# EAGLE design stm32-v1 (EAGLE 7.3.0)
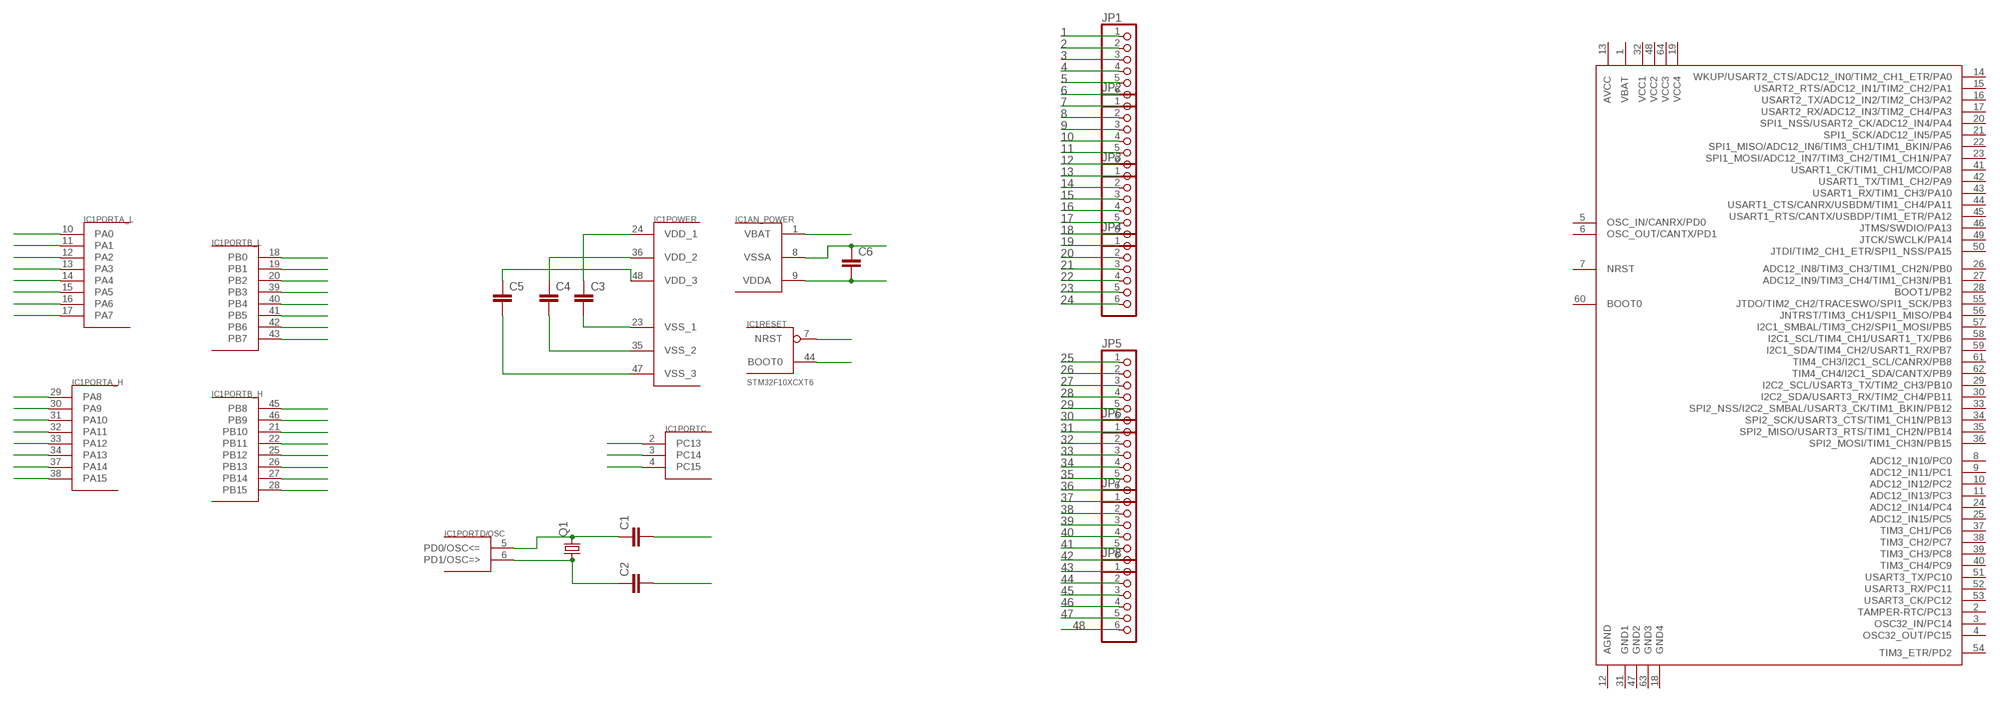
[diagram p0: schematic, sheet 1]

## Parts
C1  CAP1206  [1206]
C2  CAP1206  [1206]
C3  CAP1206  [1206]
C4  CAP1206  [1206]
C5  CAP1206  [1206]
C6  CAP1206  [1206]
IC1  STM32F10XCXT6  [TQFP48]
JP1  PINHD-1X6  [1X06]
JP2  PINHD-1X6  [1X06]
JP3  PINHD-1X6  [1X06]
JP4  PINHD-1X6  [1X06]
JP5  PINHD-1X6  [1X06]
JP6  PINHD-1X6  [1X06]
JP7  PINHD-1X6  [1X06]
JP8  PINHD-1X6  [1X06]
Q1  CRYSTAL5X3  [CRYSTAL-SMD-5X3]
U$2  STM32F103X8/B  [LQFP64]

## Nets
1: IC1.1(AN_POWER:VBAT) JP1.1
2: IC1.2(PORTC:PC13) JP1.2
3: IC1.3(PORTC:PC14) JP1.3
4: IC1.4(PORTC:PC15) JP1.4
5: C1.2 JP1.5
6: C2.2 JP1.6
7: IC1.7(RESET:NRST) JP2.1
8: C6.1 IC1.8(AN_POWER:VSSA) JP2.2
9: C6.2 IC1.9(AN_POWER:VDDA) JP2.3
10: IC1.10(PORTA_L:PA0) JP2.4
11: IC1.11(PORTA_L:PA1) JP2.5
12: IC1.12(PORTA_L:PA2) JP2.6
13: IC1.13(PORTA_L:PA3) JP3.1
14: IC1.14(PORTA_L:PA4) JP3.2
15: IC1.15(PORTA_L:PA5) JP3.3
16: IC1.16(PORTA_L:PA6) JP3.4
17: IC1.17(PORTA_L:PA7) JP3.5
18: IC1.18(PORTB_L:PB0) JP3.6
19: IC1.19(PORTB_L:PB1) JP4.1
20: IC1.20(PORTB_L:PB2) JP4.2
21: IC1.21(PORTB_H:PB10) JP4.3
22: IC1.22(PORTB_H:PB11) JP4.4
23: C3.2 IC1.23(POWER:VSS_1) JP4.5
24: C3.1 IC1.24(POWER:VDD_1) JP4.6
25: IC1.25(PORTB_H:PB12) JP5.1
26: IC1.26(PORTB_H:PB13) JP5.2
27: IC1.27(PORTB_H:PB14) JP5.3
28: IC1.28(PORTB_H:PB15) JP5.4
29: IC1.29(PORTA_H:PA8) JP5.5
30: IC1.30(PORTA_H:PA9) JP5.6
31: IC1.31(PORTA_H:PA10) JP6.1
32: IC1.32(PORTA_H:PA11) JP6.2
33: IC1.33(PORTA_H:PA12) JP6.3
34: IC1.34(PORTA_H:PA13) JP6.4
35: C4.2 IC1.35(POWER:VSS_2) JP6.5
36: C4.1 IC1.36(POWER:VDD_2) JP6.6
37: IC1.37(PORTA_H:PA14) JP7.1
38: IC1.38(PORTA_H:PA15) JP7.2
39: IC1.39(PORTB_L:PB3) JP7.3
40: IC1.40(PORTB_L:PB4) JP7.4
41: IC1.41(PORTB_L:PB5) JP7.5
42: IC1.42(PORTB_L:PB6) JP7.6
43: IC1.43(PORTB_L:PB7) JP8.1
44: IC1.44(RESET:BOOT0) JP8.2
45: IC1.45(PORTB_H:PB8) JP8.3
46: IC1.46(PORTB_H:PB9) JP8.4
47: C5.2 IC1.47(POWER:VSS_3) JP8.5
48: C5.1 IC1.48(POWER:VDD_3) JP8.6
N$9: C1.1 IC1.5(PORTD/OSC:PD0/OSC<=) Q1.3
N$10: C2.1 IC1.6(PORTD/OSC:PD1/OSC=>) Q1.1
Unconnected: U$2.1(VBAT) U$2.2(TAMPER-RTC/PC13) U$2.3(OSC32_IN/PC14) U$2.4(OSC32_OUT/PC15) U$2.5(OSC_IN/CANRX/PD0) U$2.6(OSC_OUT/CANTX/PD1) U$2.7(NRST) U$2.8(ADC12_IN10/PC0) U$2.9(ADC12_IN11/PC1) U$2.10(ADC12_IN12/PC2) U$2.11(ADC12_IN13/PC3) U$2.12(AGND) U$2.13(AVCC) U$2.14(WKUP/USART2_CTS/ADC12_IN0/TIM2_CH1_ETR/PA0) U$2.15(USART2_RTS/ADC12_IN1/TIM2_CH2/PA1) U$2.16(USART2_TX/ADC12_IN2/TIM2_CH3/PA2) U$2.17(USART2_RX/ADC12_IN3/TIM2_CH4/PA3) U$2.18(GND4) U$2.19(VCC4) U$2.20(SPI1_NSS/USART2_CK/ADC12_IN4/PA4) U$2.21(SPI1_SCK/ADC12_IN5/PA5) U$2.22(SPI1_MISO/ADC12_IN6/TIM3_CH1/TIM1_BKIN/PA6) U$2.23(SPI1_MOSI/ADC12_IN7/TIM3_CH2/TIM1_CH1N/PA7) U$2.24(ADC12_IN14/PC4) U$2.25(ADC12_IN15/PC5) U$2.26(ADC12_IN8/TIM3_CH3/TIM1_CH2N/PB0) U$2.27(ADC12_IN9/TIM3_CH4/TIM1_CH3N/PB1) U$2.28(BOOT1/PB2) U$2.29(I2C2_SCL/USART3_TX/TIM2_CH3/PB10) U$2.30(I2C2_SDA/USART3_RX/TIM2_CH4/PB11) U$2.31(GND1) U$2.32(VCC1) U$2.33(SPI2_NSS/I2C2_SMBAL/USART3_CK/TIM1_BKIN/PB12) U$2.34(SPI2_SCK/USART3_CTS/TIM1_CH1N/PB13) U$2.35(SPI2_MISO/USART3_RTS/TIM1_CH2N/PB14) U$2.36(SPI2_MOSI/TIM1_CH3N/PB15) U$2.37(TIM3_CH1/PC6) U$2.38(TIM3_CH2/PC7) U$2.39(TIM3_CH3/PC8) U$2.40(TIM3_CH4/PC9) U$2.41(USART1_CK/TIM1_CH1/MCO/PA8) U$2.42(USART1_TX/TIM1_CH2/PA9) U$2.43(USART1_RX/TIM1_CH3/PA10) U$2.44(USART1_CTS/CANRX/USBDM/TIM1_CH4/PA11) U$2.45(USART1_RTS/CANTX/USBDP/TIM1_ETR/PA12) U$2.46(JTMS/SWDIO/PA13) U$2.47(GND2) U$2.48(VCC2) U$2.49(JTCK/SWCLK/PA14) U$2.50(JTDI/TIM2_CH1_ETR/SPI1_NSS/PA15) U$2.51(USART3_TX/PC10) U$2.52(USART3_RX/PC11) U$2.53(USART3_CK/PC12) U$2.54(TIM3_ETR/PD2) U$2.55(JTDO/TIM2_CH2/TRACESWO/SPI1_SCK/PB3) U$2.56(JNTRST/TIM3_CH1/SPI1_MISO/PB4) U$2.57(I2C1_SMBAL/TIM3_CH2/SPI1_MOSI/PB5) U$2.58(I2C1_SCL/TIM4_CH1/USART1_TX/PB6) U$2.59(I2C1_SDA/TIM4_CH2/USART1_RX/PB7) U$2.60(BOOT0) U$2.61(TIM4_CH3/I2C1_SCL/CANRX/PB8) U$2.62(TIM4_CH4/I2C1_SDA/CANTX/PB9) U$2.63(GND3) U$2.64(VCC3)

## Library data of the parts
C1-C6 = SparkFun:CAP: Capacitor Standard 0603 ceramic capacitor, and 0.1" leaded capacitor.
IC1 = stm32:STM32F10XCXT6: ST STM32F101/103 48pin LQFP
JP1-JP8 = pinhead:PINHD-1X6: PIN HEADER
Q1 = SparkFun:CRYSTAL: Crystals Various standard crystals. Proven footprints. Spark Fun Electronics SKU : COM-00534
U$2 = stm32f103rx_lqfp64:STM32F103X8/B: Medium-density performance line ARM-based 32-bit MCU with 64 or 128 KB Flash, USB, CAN, 7 timers, 2 ADCs, 9 communication interfaces

## Board
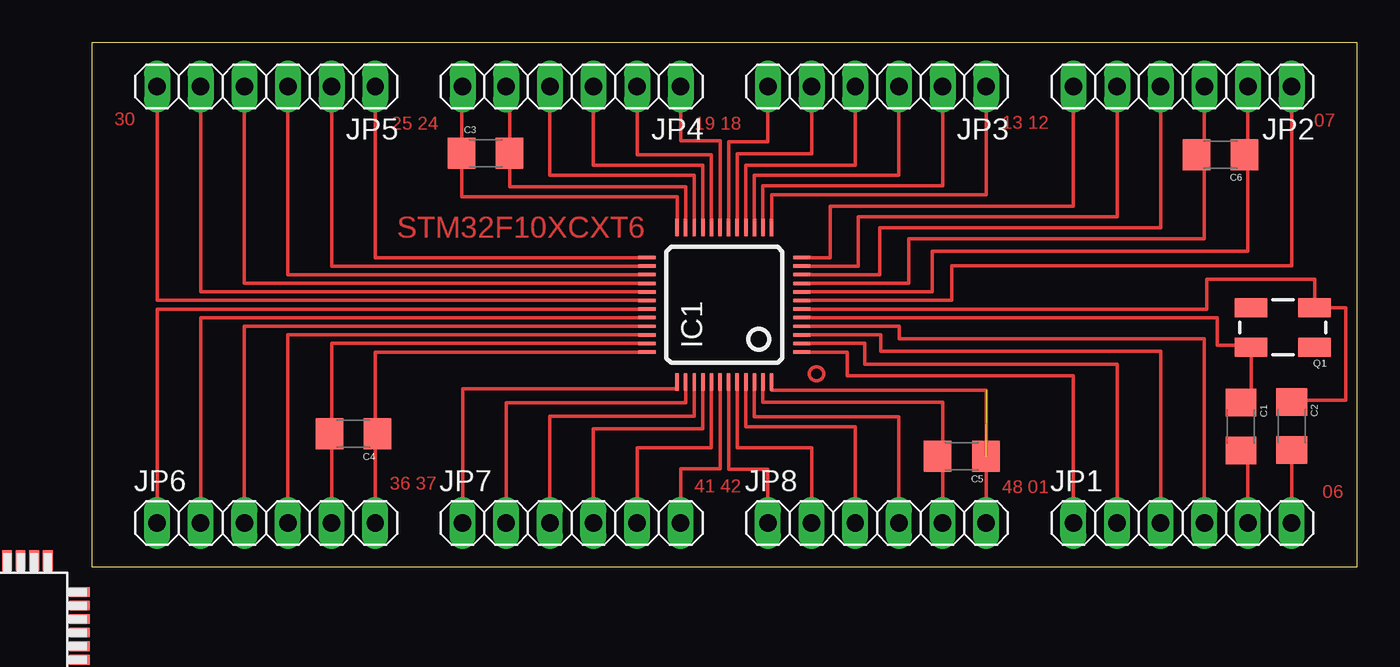
[diagram p1: board, top side]

Size 73.66 x 30.48 mm. Coordinates in mm from the lower left corner, seen from the top.
Outline: 0,0 73.66,0 73.66,30.48 0,30.48 0,0
Copper layers (1*16): Top 0.035mm / dielectric 1.5mm / Bottom 0.035mm
Design rules "default *": minimum track width 8mil, minimum drill 24mil, track to track 8mil, track to pad 8mil, pad to pad 8mil, via to via 8mil, smd to smd 8mil, copper to edge 40mil, drill to drill 8mil, minimum pad ring 10mil, minimum via ring 8mil, stop-mask expansion 4mil, vias tented up to drill 0mil, thermal gap 10mil

### Footprints (pad centres in the part's own frame; a part is rotated, then mirrored left to right if it is on the bottom)
1206 = smd 1.6 x 1.8: 1 -1.4,0; 2 1.4,0
TQFP48 = smd 0.2 x 1: 1 -2.75,-4.5; 2 -2.25,-4.5; 3 -1.75,-4.5; 4 -1.25,-4.5; 5 -0.75,-4.5; 6 -0.25,-4.5; 7 0.25,-4.5; 8 0.75,-4.5; 9 1.25,-4.5; 10 1.75,-4.5; 11 2.25,-4.5; 12 2.75,-4.5; 25 2.75,4.5; 26 2.25,4.5; 27 1.75,4.5; 28 1.25,4.5; 29 0.75,4.5; 30 0.25,4.5; 31 -0.25,4.5; 32 -0.75,4.5; 33 -1.25,4.5; 34 -1.75,4.5; 35 -2.25,4.5; 36 -2.75,4.5 | smd 1 x 0.2: 13 4.5,-2.75; 14 4.5,-2.25; 15 4.5,-1.75; 16 4.5,-1.25; 17 4.5,-0.75; 18 4.5,-0.25; 19 4.5,0.25; 20 4.5,0.75; 21 4.5,1.25; 22 4.5,1.75; 23 4.5,2.25; 24 4.5,2.75; 37 -4.5,2.75; 38 -4.5,2.25; 39 -4.5,1.75; 40 -4.5,1.25; 41 -4.5,0.75; 42 -4.5,0.25; 43 -4.5,-0.25; 44 -4.5,-0.75; 45 -4.5,-1.25; 46 -4.5,-1.75; 47 -4.5,-2.25; 48 -4.5,-2.75
1X06 = drill 1.016 long: 1 -6.35,0; 2 -3.81,0; 3 -1.27,0; 4 1.27,0; 5 3.81,0; 6 6.35,0
CRYSTAL-SMD-5X3 = smd 1.9 x 1.1: 1 -1.85,-1.15; 2 1.85,-1.15; 3 1.85,1.15; 4 -1.85,1.15
LQFP64 = smd 1.194 x 0.559: 1 -7.76,5.905; 2 -7.76,5.118; 3 -7.76,4.331; 4 -7.76,3.543; 5 -7.76,2.756; 6 -7.76,1.968; 7 -7.76,1.181; 8 -7.76,0.394; 9 -7.76,-0.394; 10 -7.76,-1.181; 11 -7.76,-1.968; 12 -7.76,-2.756; 13 -7.76,-3.543; 14 -7.76,-4.331; 15 -7.76,-5.118; 16 -7.76,-5.905; 33 7.76,-5.905; 34 7.76,-5.118; 35 7.76,-4.331; 36 7.76,-3.543; 37 7.76,-2.756; 38 7.76,-1.968; 39 7.76,-1.181; 40 7.76,-0.394; 41 7.76,0.394; 42 7.76,1.181; 43 7.76,1.968; 44 7.76,2.756; 45 7.76,3.543; 46 7.76,4.331; 47 7.76,5.118; 48 7.76,5.905 | smd 0.559 x 1.194: 17 -5.905,-7.76; 18 -5.118,-7.76; 19 -4.331,-7.76; 20 -3.543,-7.76; 21 -2.756,-7.76; 22 -1.968,-7.76; 23 -1.181,-7.76; 24 -0.394,-7.76; 25 0.394,-7.76; 26 1.181,-7.76; 27 1.968,-7.76; 28 2.756,-7.76; 29 3.543,-7.76; 30 4.331,-7.76; 31 5.118,-7.76; 32 5.905,-7.76; 49 5.905,7.76; 50 5.118,7.76; 51 4.331,7.76; 52 3.543,7.76; 53 2.756,7.76; 54 1.968,7.76; 55 1.181,7.76; 56 0.394,7.76; 57 -0.394,7.76; 58 -1.181,7.76; 59 -1.968,7.76; 60 -2.756,7.76; 61 -3.543,7.76; 62 -4.331,7.76; 63 -5.118,7.76; 64 -5.905,7.76

### Placement (x,y rotation side)
C1  66.9,8.15 270 top
C2  69.85,8.18 270 top
C3  22.94,24.05 0 top
C4  15.24,7.72 180 top
C5  50.65,6.43 180 top
C6  65.71,23.98 180 top
IC1  36.83,15.24 90 top
JP1  63.5,2.54 0 top
JP2  63.5,27.94 180 top
JP3  45.72,27.94 180 top
JP4  27.94,27.94 180 top
JP5  10.16,27.94 180 top
JP6  10.16,2.54 0 top
JP7  27.94,2.54 0 top
JP8  45.72,2.54 0 top
Q1  69.34,13.92 180 top
U$2  -8.46,-7.39 0 top

### Tracks (layer width: path | path; a pad name or v marks a point on that pad's centre or on a via)
1
  Top 0.203: IC1.1 43.99,12.49 43.99,11.1 57.15,11.1 JP1.1
2
  Top 0.203: IC1.2 45.01,12.99 45.01,11.79 59.69,11.79 JP1.2
3
  Top 0.203: IC1.3 45.95,13.49 45.95,12.55 62.23,12.55 JP1.3
4
  Top 0.203: IC1.4 47.02,13.99 47.02,13.26 64.77,13.26 JP1.4
5
  Top 0.203: C1.2 67.31,6.75 JP1.5
6
  Top 0.203: C2.2 JP1.6
7
  Top 0.203: JP2.1 69.85,17.5 50.06,17.5 50.06,15.49 IC1.7
8
  Top 0.203: 67.31,24.26 67.31,18.36 48.92,18.36 48.92,15.99 IC1.8 | 67.31,24.26 JP2.2 | C6.1 67.11,24.26 67.31,24.26
9
  Top 0.203: 64.77,23.93 64.77,19.07 47.57,19.07 47.57,16.49 IC1.9 | 64.77,23.93 JP2.3 | C6.2 64.31,23.93 64.77,23.93
10
  Top 0.203: JP2.4 62.23,19.74 45.87,19.74 45.87,16.99 IC1.10
11
  Top 0.203: JP2.5 59.69,20.37 44.63,20.37 44.63,17.49 IC1.11
12
  Top 0.203: JP2.6 57.15,20.98 43,20.98 43,17.99 IC1.12
13
  Top 0.203: IC1.13 39.58,21.64 52.07,21.64 JP3.1
14
  Top 0.203: IC1.14 39.08,22.17 49.53,22.17 JP3.2
15
  Top 0.203: IC1.15 38.58,22.78 46.99,22.78 JP3.3
16
  Top 0.203: IC1.16 38.08,23.37 44.45,23.37 JP3.4
17
  Top 0.203: IC1.17 37.58,24.03 41.91,24.03 JP3.5
18
  Top 0.203: IC1.18 37.08,24.74 39.37,24.74 JP3.6
19
  Top 0.203: IC1.19 36.58,24.79 34.29,24.79 JP4.1
20
  Top 0.203: IC1.20 36.08,23.98 31.75,23.98 JP4.2
21
  Top 0.203: IC1.21 35.58,23.37 29.21,23.37 JP4.3
22
  Top 0.203: IC1.22 35.08,22.78 34.01,22.78 33.81,22.78 26.67,22.78 JP4.4
23
  Top 0.203: JP4.5 24.34,27.94 C3.2 24.34,22.12 34.58,22.12 IC1.23
24
  Top 0.203: JP4.6 21.54,27.94 C3.1 21.54,21.54 32.66,21.54 32.82,21.54 34.08,21.54 IC1.24
25
  Top 0.203: IC1.25 16.51,17.99 JP5.1
26
  Top 0.203: IC1.26 13.97,17.49 JP5.2
27
  Top 0.203: IC1.27 11.43,16.99 JP5.3
28
  Top 0.203: IC1.28 8.89,16.49 JP5.4
29
  Top 0.203: IC1.29 6.35,15.99 JP5.5
30
  Top 0.203: IC1.30 3.81,15.49 JP5.6
31
  Top 0.203: IC1.31 3.81,14.99 JP6.1
32
  Top 0.203: IC1.32 6.35,14.49 JP6.2
33
  Top 0.203: IC1.33 8.89,13.99 JP6.3
34
  Top 0.203: IC1.34 11.43,13.49 JP6.4
35
  Top 0.203: IC1.35 13.97,12.99 13.97,7.72 | JP6.5 13.97,7.72 | 13.97,7.72 C4.2
36
  Top 0.203: IC1.36 16.51,12.49 16.51,7.72 | JP6.6 16.51,7.72 | 16.51,7.72 C4.1
37
  Top 0.203: IC1.37 34.08,10.34 21.59,10.34 JP7.1
38
  Top 0.203: IC1.38 34.58,9.53 24.13,9.53 JP7.2
39
  Top 0.203: IC1.39 35.08,8.76 33.35,8.76 33.22,8.76 26.67,8.76 JP7.3
40
  Top 0.203: IC1.40 35.58,8.03 29.21,8.03 JP7.4
41
  Top 0.203: IC1.41 36.08,6.91 31.75,6.91 JP7.5
42
  Top 0.203: IC1.42 36.58,5.69 34.29,5.69 JP7.6
43
  Top 0.203: IC1.43 37.08,5.66 39.37,5.66 JP8.1
44
  Top 0.203: IC1.44 37.58,6.91 41.91,6.91 JP8.2
45
  Top 0.203: IC1.45 38.08,8.13 44.45,8.13 JP8.3
46
  Top 0.203: IC1.46 38.58,8.71 46.99,8.71 JP8.4
47
  Top 0.203: IC1.47 39.08,9.58 49.53,9.58 49.53,6.43 | JP8.5 49.53,6.35 49.53,6.43 | 49.53,6.43 C5.2
48  (1 unrouted)
  Top 0.203: IC1.48 39.58,10.26 52.07,10.26 JP8.6
N$9
  Top 0.203: C1.1 67.49,9.55 Q1.3 67.49,12.88 65.53,12.88 65.53,14.49 IC1.5
N$10
  Top 0.203: IC1.6 64.9,14.99 64.9,16.74 71.19,16.74 Q1.1 73,15.07 73,9.68 69.85,9.68 C2.1
(copper drawn outside any net)
  shapes: Top circle x1

### Text on the board
Top: 30 | 07 | 25 24 | 19 18 | 13 12 | STM32F10XCXT6 | 31 | 36 37 | 41 42 | 48 01 | 06